# EAGLE design shield (EAGLE 8.7.1)

## Sheet 1 of 2
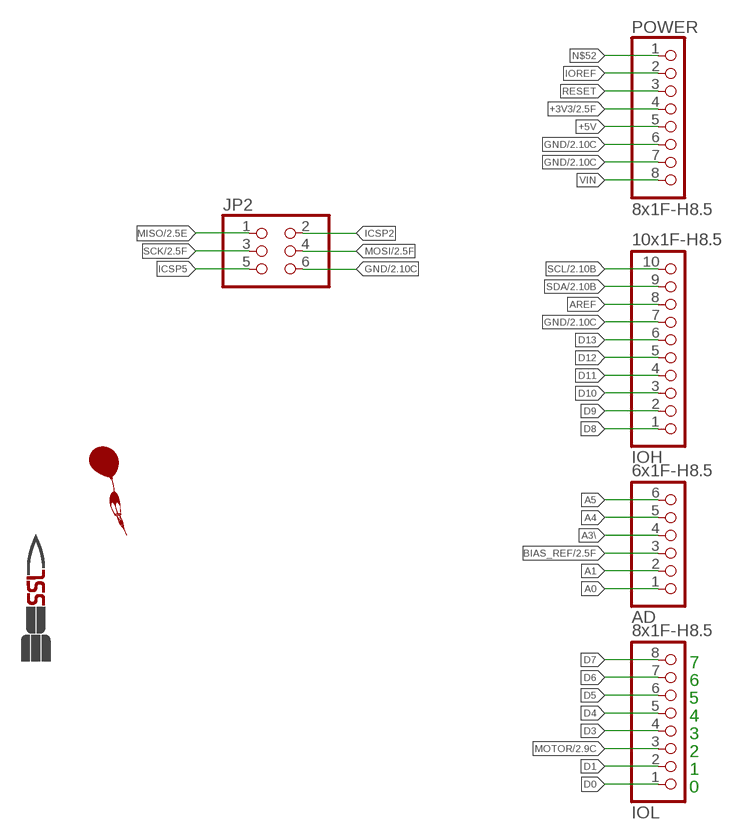
[diagram p0: schematic, sheet 1]

### Parts
AD  6x1F-H8.5  PINHD-1X6  [1X06]
IOH  10x1F-H8.5  PINHD-1X10_ARD  [1X10]
IOL  8x1F-H8.5  PINHD-1X8  [1X08]
JP2  PINHD-2X3  [2X03]
POWER  8x1F-H8.5  PINHD-1X8  [1X08]
U$1  BALLOON  [BALLOON]
U$2  SSLORIG  [SSL]

### Nets
+3V3: POWER.4 ; also sheet 2
+5V: POWER.5
A0: AD.1
A1: AD.2
A3\: AD.4
A4: AD.5
A5: AD.6
AREF: IOH.8
BIAS_REF: AD.3 ; also sheet 2
D0: IOL.1
D1: IOL.2
D3: IOL.4
D4: IOL.5
D5: IOL.6
D6: IOL.7
D7: IOL.8
D8: IOH.1
D9: IOH.2
D10: IOH.3
D11: IOH.4
D12: IOH.5
D13: IOH.6
GND: IOH.7 JP2.6 POWER.6 POWER.7 ; also sheet 2
ICSP2: JP2.2
ICSP5: JP2.5
IOREF: POWER.2
MISO: JP2.1 ; also sheet 2
MOSI: JP2.4 ; also sheet 2
MOTOR: IOL.3 ; also sheet 2
N$52: POWER.1
RESET: POWER.3
SCK: JP2.3 ; also sheet 2
SCL: IOH.10 ; also sheet 2
SDA: IOH.9 ; also sheet 2
VIN: POWER.8

### Notes on the sheet
- 7
- 6
- 5
- 4
- 3
- 2
- 1
- 0

## Sheet 2 of 2
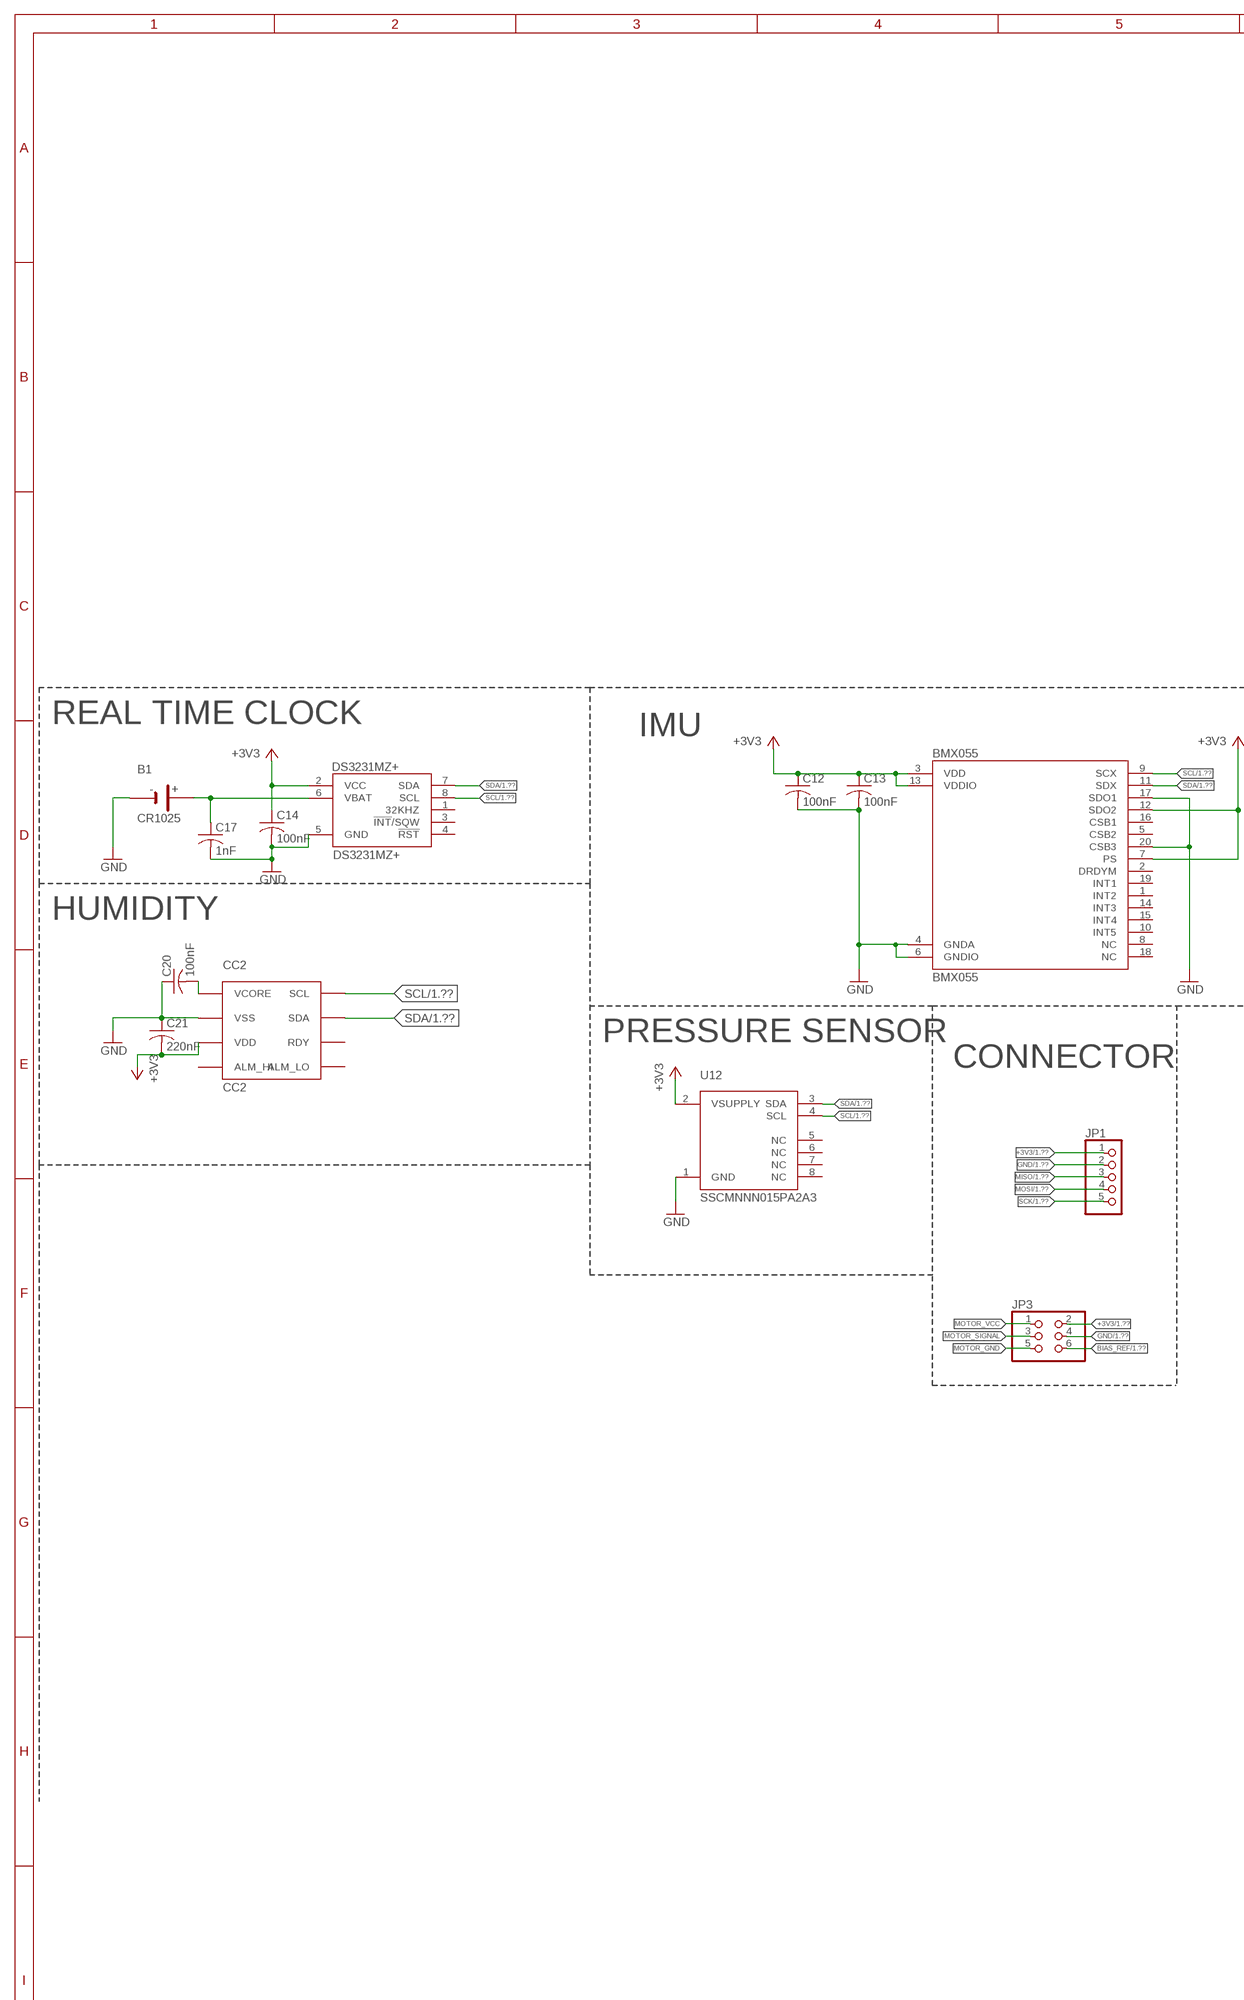
[diagram p1: schematic, sheet 2, part 1 of 2]
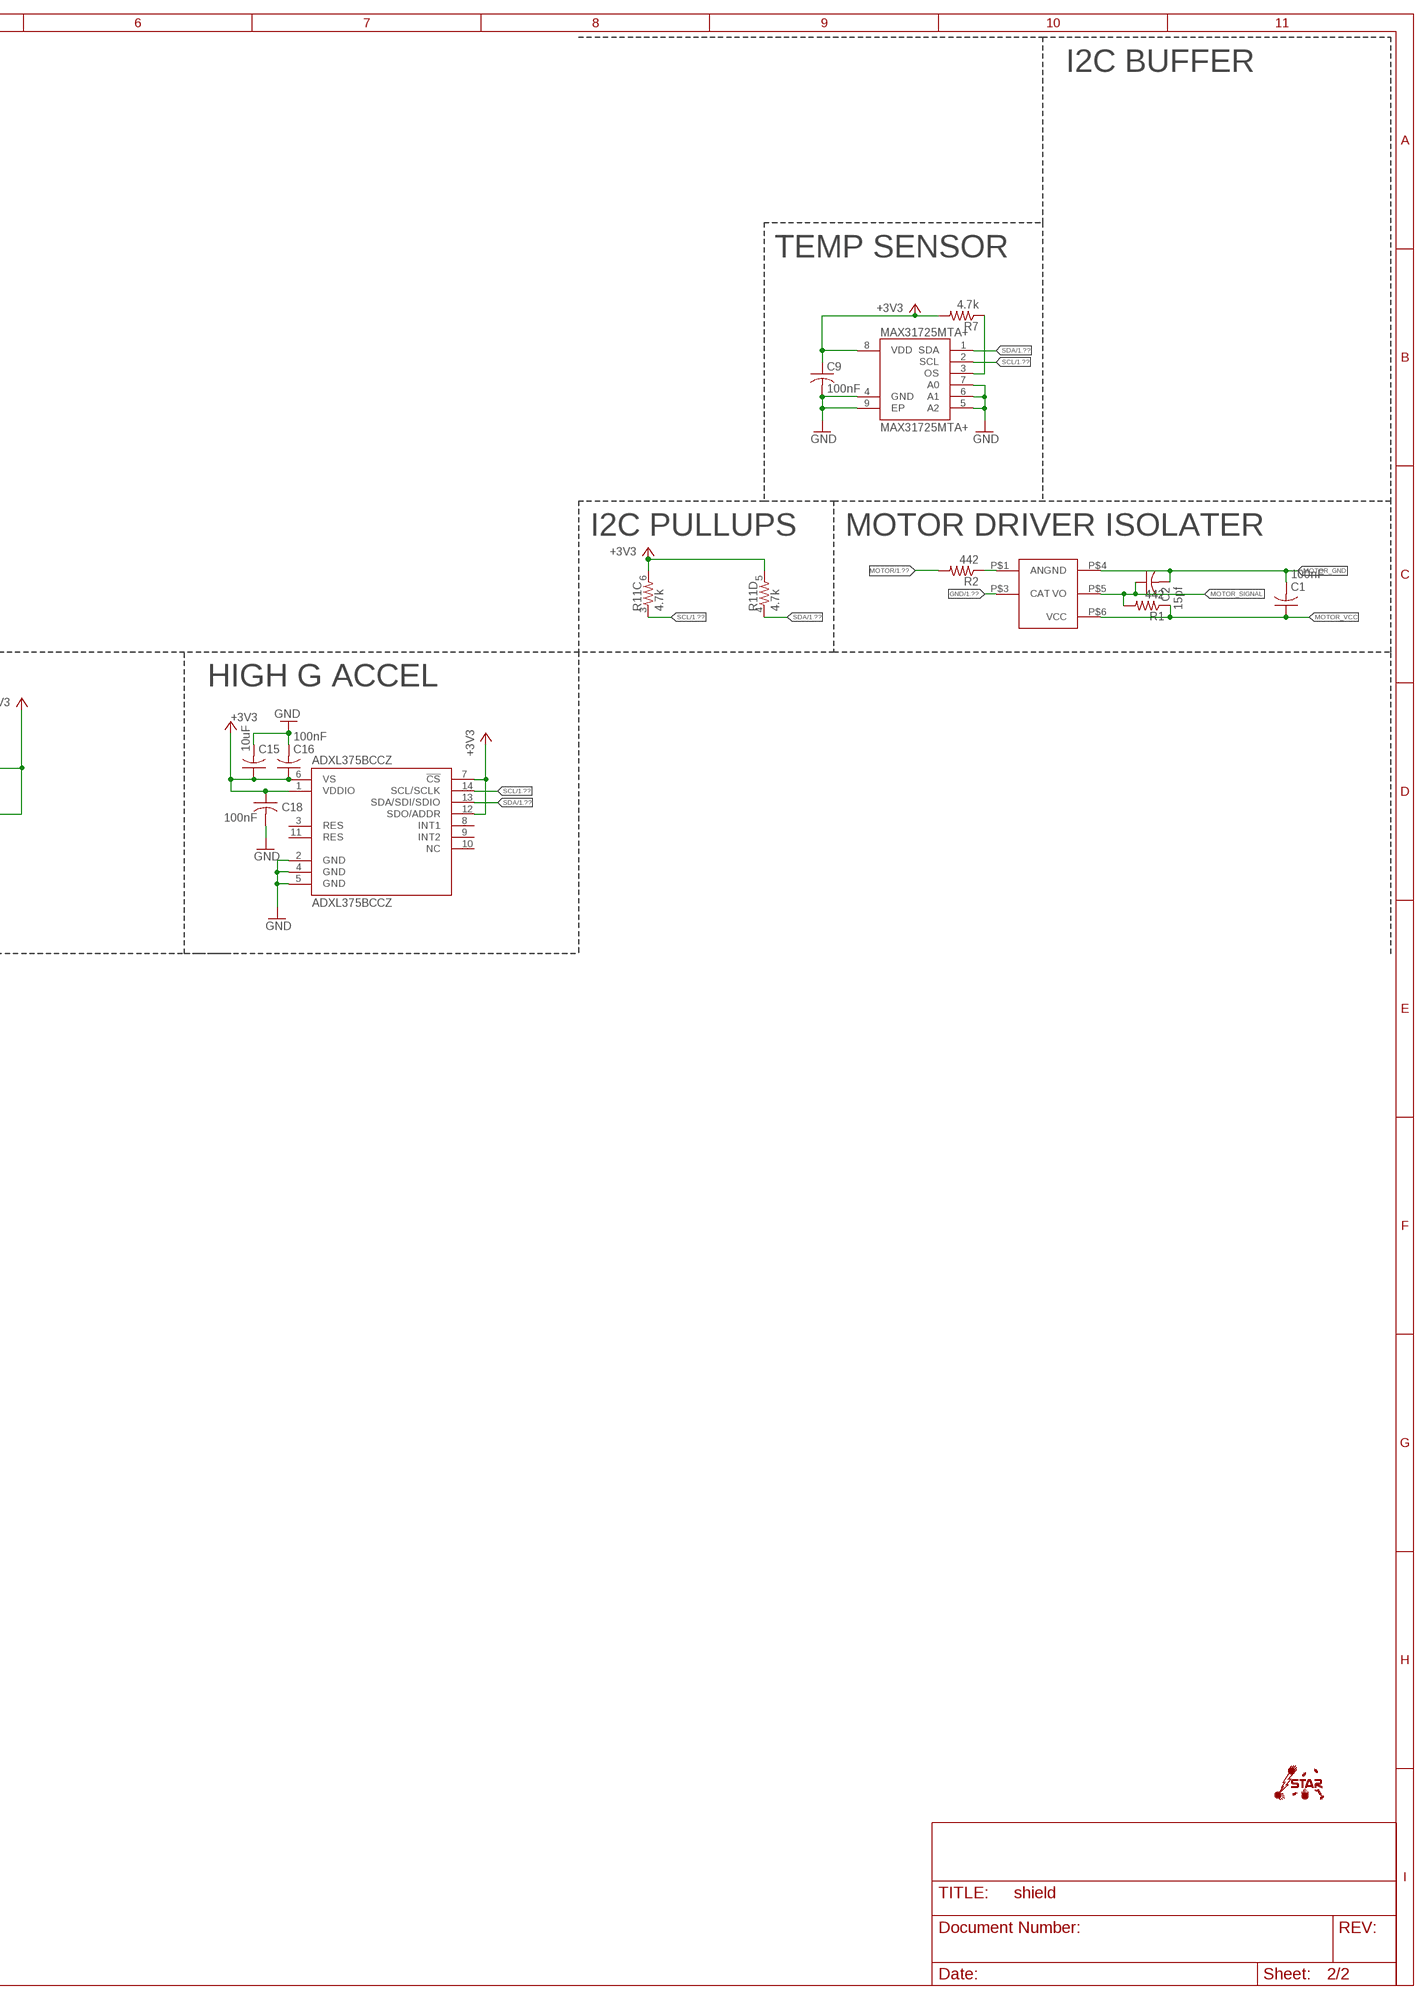
[diagram p2: schematic, sheet 2, part 2 of 2]

### Parts
ADXL375BCCZ  ADXL375BCCZ  [LGA-14]
B1  CR1025  [CR1025]
BMX055  BMX055  [LGA-20]
C1  100nF  C-USC0603  [C0603]
C2  15pf  C-USC0603  [C0603]
C9  100nF  C-USC0603  [C0603]
C12  100nF  C-USC0603  [C0603]
C13  100nF  C-USC0603  [C0603]
C14  100nF  C-USC0603  [C0603]
C15  10uF  C-USC0603  [C0603]
C16  100nF  C-USC0603  [C0603]
C17  1nF  C-USC0603  [C0603]
C18  100nF  C-USC0603  [C0603]
C20  100nF  C-USC0603  [C0603]
C21  220nF  C-USC0603  [C0603]
CC2  CC2  [CC2]
DS3231MZ+  DS3231MZ+  [SOIC-8]
IMAG2  STAR  [STAR_.3IN]
JP1  PINHD-1X5  [1X05]
JP3  PINHD-2X3  [2X03]
MAX31725MTA+  MAX31725MTA+  [DFN-8]
MOTORDRIVER  FODM8061-D  [SO5]
R1  442  R-US_R0805  [R0805]
R2  442  R-US_R0805  [R0805]
R7  4.7k  R-US_R0603  [R0603]
R11  4.7k  RESISTOR-ARRAY0603-ARV  [0603-ARV]
U12  SSCMNNN015PA2A3  [HSC-SMT-8]

### Nets
+3V3: ADXL375BCCZ.1(VDDIO) ADXL375BCCZ.6(VS) ADXL375BCCZ.7(!CS!) ADXL375BCCZ.12(SDO/ADDR) BMX055.3(VDD) BMX055.7(PS) BMX055.12(SDO2) BMX055.13(VDDIO) C9.1 C12.1 C13.1 C14.1 C15.1 C16.1 C18.1 C21.2 CC2.P$7(VDD) DS3231MZ+.2(VCC) JP1.1 JP3.2 MAX31725MTA+.8(VDD) R7.2 R11.5 R11.6 U12.2(VSUPPLY) ; also sheet 1
BIAS_REF: JP3.6 ; also sheet 1
GND: ADXL375BCCZ.2(GND) ADXL375BCCZ.4(GND) ADXL375BCCZ.5(GND) B1.3(-) BMX055.4(GNDA) BMX055.6(GNDIO) BMX055.17(SDO1) BMX055.20(CSB3) C9.2 C12.2 C13.2 C14.2 C15.2 C16.2 C17.2 C18.2 C20.1 C21.1 CC2.P$6(VSS) DS3231MZ+.5(GND) JP1.2 JP3.4 MAX31725MTA+.4(GND) MAX31725MTA+.5(A2) MAX31725MTA+.6(A1) MAX31725MTA+.7(A0) MAX31725MTA+.9(EP) MOTORDRIVER.P$3(CAT) U12.1(GND) ; also sheet 1
MISO: JP1.3 ; also sheet 1
MOSI: JP1.4 ; also sheet 1
MOTOR: R2.2 ; also sheet 1
MOTOR_GND: C1.2 C2.2 JP3.5 MOTORDRIVER.P$4(GND)
MOTOR_SIGNAL: C2.1 JP3.3 MOTORDRIVER.P$5(VO) R1.2
MOTOR_VCC: C1.1 JP3.1 MOTORDRIVER.P$6(VCC) R1.1
N$1: C20.2 CC2.P$5(VCORE)
N$2: MOTORDRIVER.P$1(AN) R2.1
N$30: MAX31725MTA+.3(OS) R7.1
N$31: B1.1(+) B1.2(+) C17.1 DS3231MZ+.6(VBAT)
SCK: JP1.5 ; also sheet 1
SCL: ADXL375BCCZ.14(SCL/SCLK) BMX055.9(SCX) CC2.P$4(SCL) DS3231MZ+.8(SCL) MAX31725MTA+.2(SCL) R11.3 U12.4(SCL) ; also sheet 1
SDA: ADXL375BCCZ.13(SDA/SDI/SDIO) BMX055.11(SDX) CC2.P$3(SDA) DS3231MZ+.7(SDA) MAX31725MTA+.1(SDA) R11.4 U12.3(SDA) ; also sheet 1
Unconnected: ADXL375BCCZ.3(RES) ADXL375BCCZ.8(INT1) ADXL375BCCZ.9(INT2) ADXL375BCCZ.10(NC) ADXL375BCCZ.11(RES) BMX055.1(INT2) BMX055.2(DRDYM) BMX055.5(CSB2) BMX055.8(NC) BMX055.10(INT5) BMX055.14(INT3) BMX055.15(INT4) BMX055.16(CSB1) BMX055.18(NC) BMX055.19(INT1) CC2.P$1(ALM_LO) CC2.P$2(RDY) CC2.P$8(ALM_HI) DS3231MZ+.1(32KHZ) DS3231MZ+.3(!INT!/SQW) DS3231MZ+.4(!RST!) R11.1 R11.2 R11.7 R11.8 U12.5(NC) U12.6(NC) U12.7(NC) U12.8(NC)

### Notes on the sheet
- I2C BUFFER
- TEMP SENSOR
- I2C PULLUPS | MOTOR DRIVER ISOLATER
- REAL TIME CLOCK | HIGH G ACCEL
- IMU
- HUMIDITY
- PRESSURE SENSOR
- CONNECTOR

## Library data of the parts
AD = SmartPrj:PINHD-1X6: PIN HEADER
ADXL375BCCZ = NR_IC:ADXL375BCCZ
B1 = NR_connectors:CR1025
BMX055 = NR_IC:BMX055
C1 C2 C9 C12-C18 C20 C21 = resistor:C-US: CAPACITOR, American symbol
CC2 = NR_IC:CC2
DS3231MZ+ = NR_IC:DS3231MZ+
IMAG2 = images:STAR
IOH = SmartPrj:PINHD-1X10_ARD: PIN HEADER
IOL POWER = SmartPrj:PINHD-1X8: PIN HEADER
JP1 = pinhead:PINHD-1X5: PIN HEADER
JP2 JP3 = pinhead:PINHD-2X3: PIN HEADER
MAX31725MTA+ = NR_IC:MAX31725MTA+
MOTORDRIVER = optoisolater:FODM8061-D
R1 R2 R7 = resistor:R-US_: RESISTOR, American symbol
R11 = SparkFun-Passives:RESISTOR-ARRAY: Array Chip Resistor Source: RS Component / Phycomp
U12 = NR_IC:SSCMNNN015PA2A3
U$1 = images:BALLOON
U$2 = images:SSL

## Net classes
0 default: width 0.152 mm, drill 0.381 mm, clearance 0.152 mm
1 power: width 0.61 mm, drill 0.61 mm, clearance 0.254 mm
2 gnd: width 0.305 mm, drill 0.559 mm, clearance 0.254 mm
3 usbvcc: width 0.508 mm, drill 0.61 mm, clearance 0.254 mm
4 aref: width 0.406 mm, drill 0.61 mm, clearance 0.254 mm

## Board
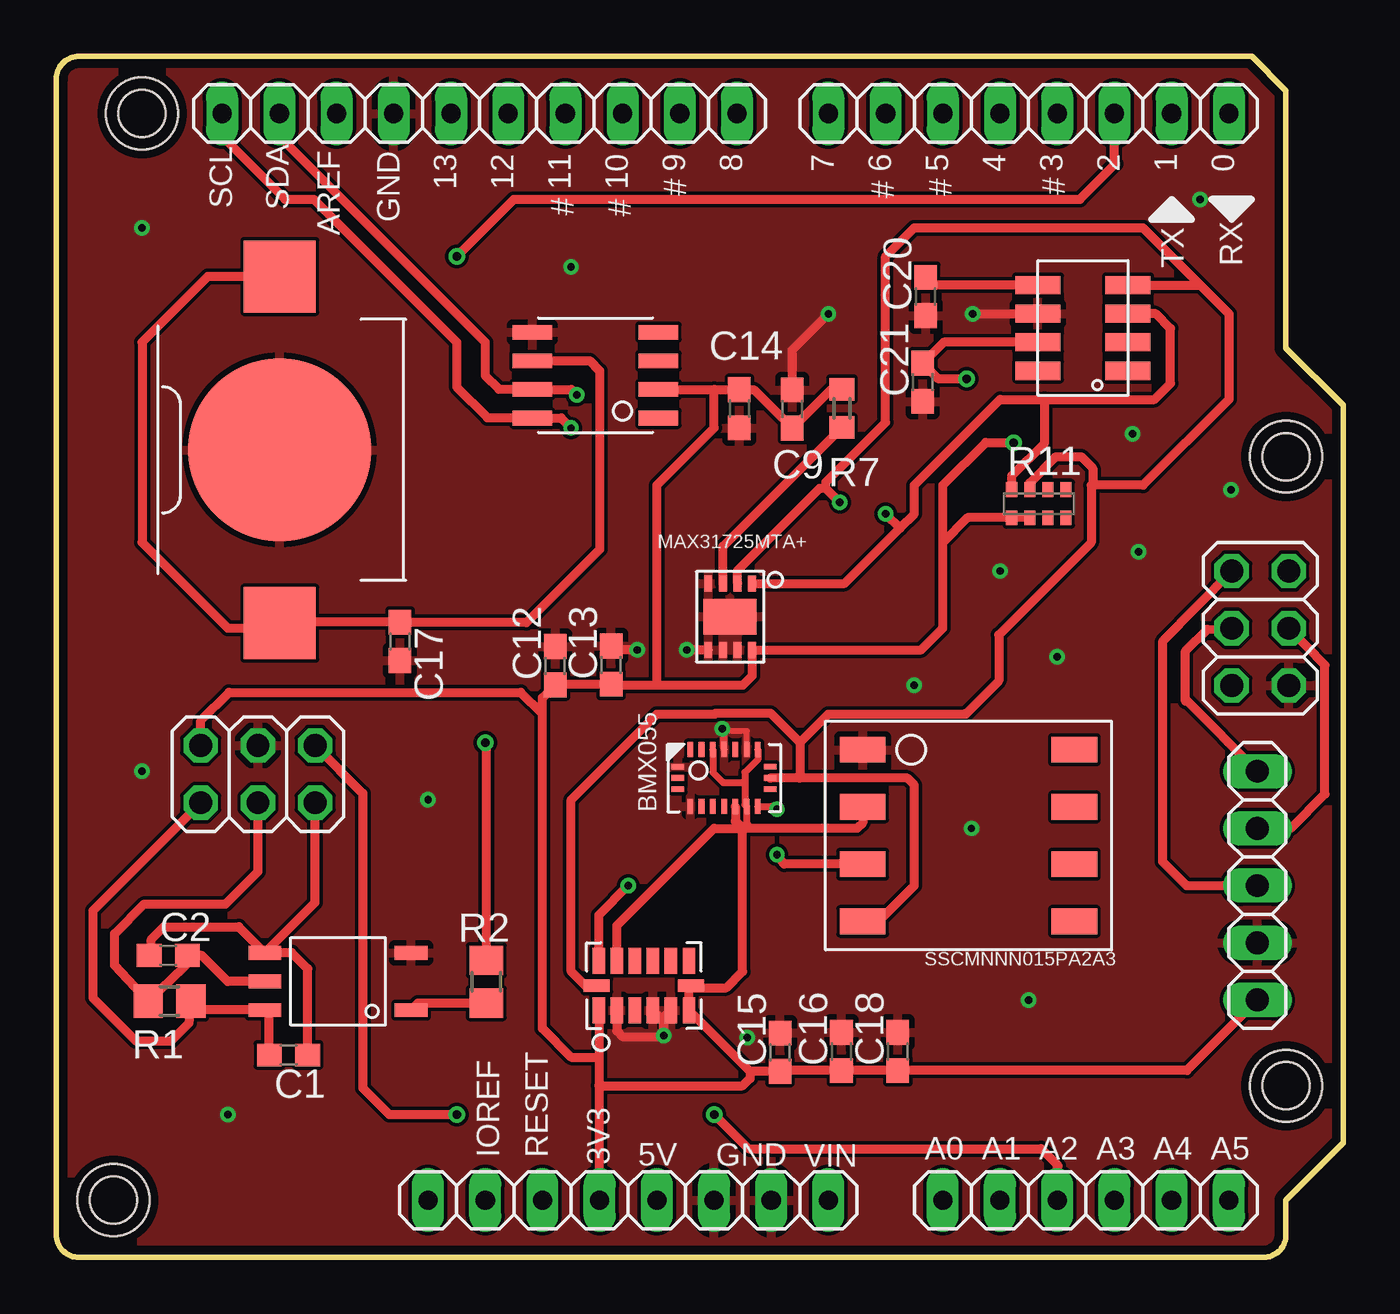
[diagram p3: board, top side]
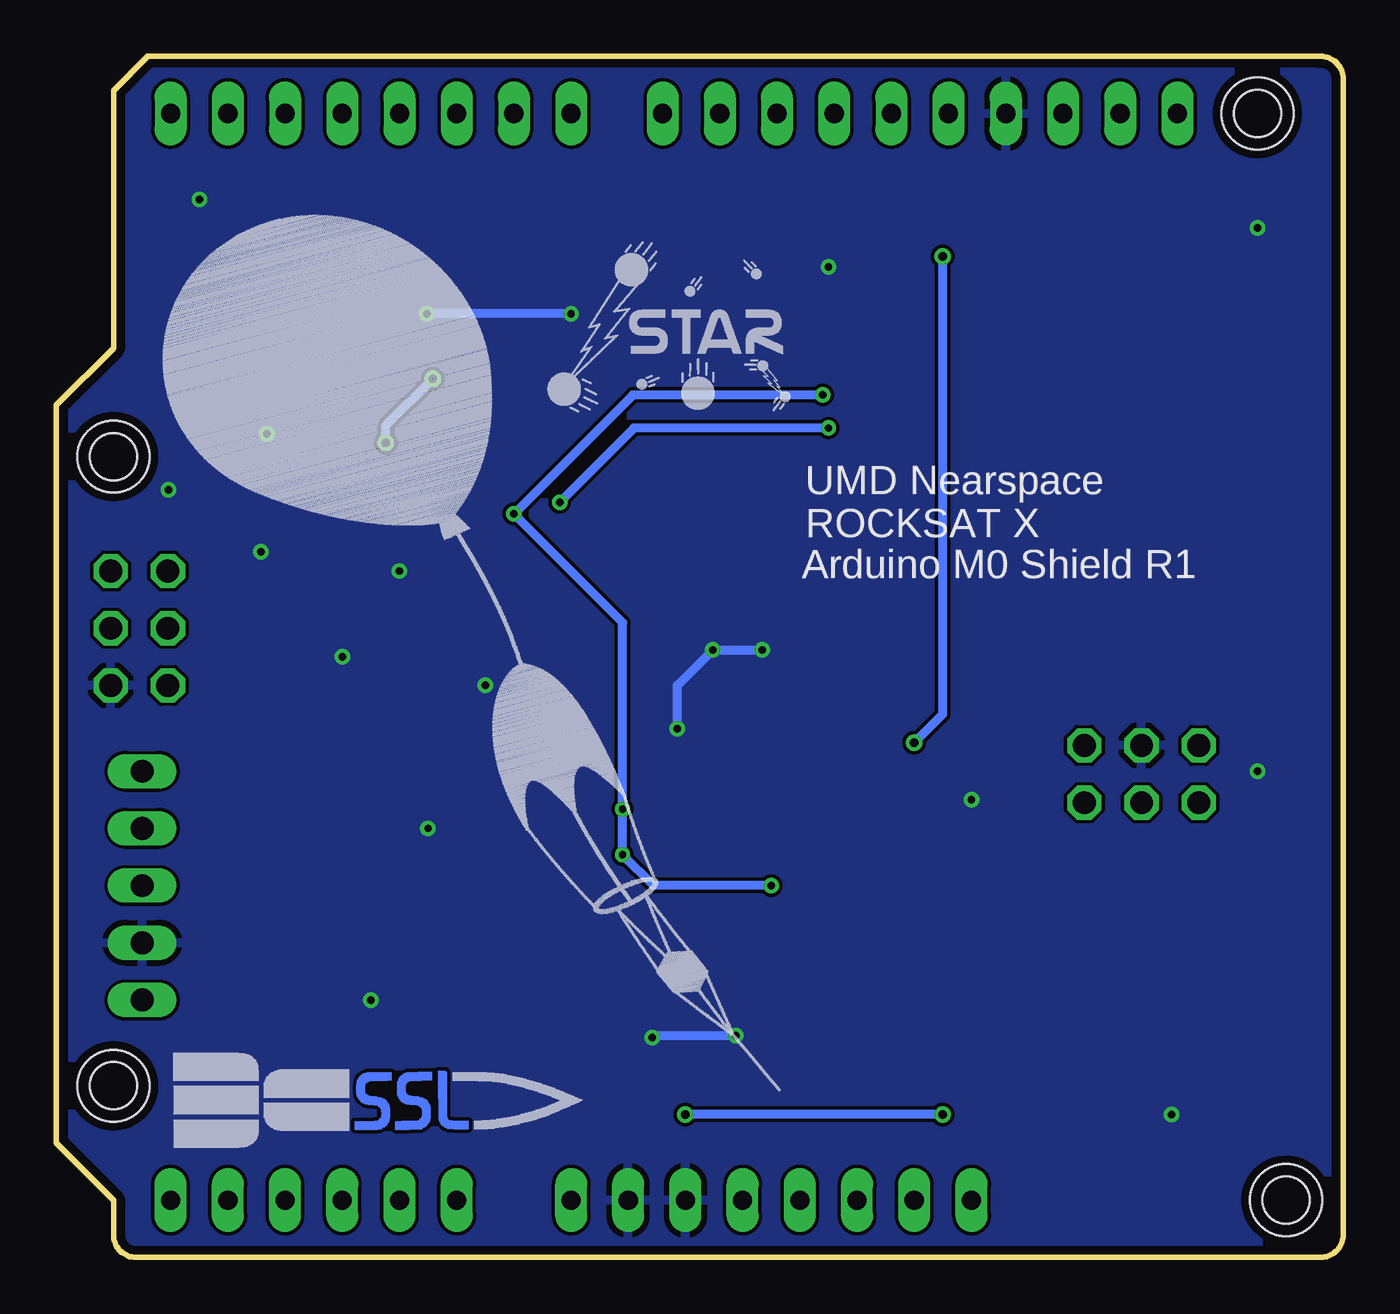
[diagram p4: board, bottom side, seen from below]

Size 57.15 x 53.34 mm. Coordinates in mm from the lower left corner, seen from the top.
Outline: 53.09,53.34 54.61,51.82 54.61,40.39 57.15,37.85 57.15,5.08 54.61,2.54 54.61,1 arc-90 53.61,0 1,0 arc-90 0,1 0,52.34 arc-90 1.02,53.34 53.09,53.34
Copper layers (1*16): Top 0.0356mm / dielectric 1.5011mm / Bottom 0.0356mm
Design rules "OshPark": minimum track width 6mil, minimum drill 13mil, track to track 6mil, track to pad 6mil, pad to pad 6mil, via to via 6mil, smd to smd 6mil, copper to edge 15mil, drill to drill 6mil, minimum pad ring 7mil, minimum via ring 7mil, stop-mask expansion 3mil, vias tented up to drill 0mil, thermal gap 10mil
Holes 3.2 mm at 54.61,35.56 54.61,7.62 3.81,50.8 2.54,2.54
Holes 2.1 mm at 3.81,50.8 54.61,35.56 54.61,7.62 2.54,2.54
vRestrict: area 11.4,44.1 to 13.2,49.1; area 14,45.5 to 15.6,49.1; area 17,45.3 to 18.2,48.8; area 19.6,45.3 to 20.7,48.8; area 22.1,45.3 to 23.2,48.8; area 24.6,45.3 to 25.8,48.8; area 27.3,47.2 to 28.4,48.8; area 28.8,45.1 to 36.2,46.9; area 48.9,44.2 to 50.3,46.7; area 51.4,44.2 to 52.8,46.7; area 49.9,35.8 to 53.3,37.2; area -10.8,21.8 to -9.4,30.1; 14 more areas

### Footprints (pad centres in the part's own frame; a part is rotated, then mirrored left to right if it is on the bottom)
1X06 = drill 0.85 pad 1.422 long: 1 -6.35,0; 2 -3.81,0; 3 -1.27,0; 4 1.27,0; 5 3.81,0; 6 6.35,0
LGA-14 = smd 1.145 x 0.55: 1 -1.097,2; 2 -1.097,1.2; 3 -1.097,0.4; 4 -1.097,-0.4; 5 -1.097,-1.2; 6 -1.097,-2; 8 1.097,-2; 9 1.097,-1.2; 10 1.097,-0.4; 11 1.097,0.4; 12 1.097,1.2; 13 1.097,2 | smd 0.55 x 1.145: 7 0,-2.098; 14 0,2.098
CR1025 = smd 3.2 x 3.2: 1 -7.695,0; 2 7.695,0 | smd 8.13 x 8.13: 3 0,0
LGA-20 = smd 0.675 x 0.25: 1 1.262,1.5; 2 1.262,1; 3 1.262,0.5; 4 1.262,0; 5 1.262,-0.5; 6 1.262,-1; 7 1.262,-1.5; 11 -1.262,-1.5; 12 -1.262,-1; 13 -1.262,-0.5; 14 -1.262,0; 15 -1.262,0.5; 16 -1.262,1; 17 -1.262,1.5 | smd 0.25 x 0.55: 8 0.5,-2.05; 9 0,-2.05; 10 -0.5,-2.05; 18 -0.5,2.05; 19 0,2.05; 20 0.5,2.05
C0603 = smd 1.1 x 1: 1 -0.85,0; 2 0.85,0
CC2 = smd 2 x 0.8: P$1 2,-1.905; P$2 2,-0.635; P$3 2,0.635; P$4 2,1.905; P$5 -2,1.905; P$6 -2,0.635; P$7 -2,-0.635; P$8 -2,-1.905
SOIC-8 = smd 0.65 x 1.75: 1 -1.905,-2.8; 2 -0.635,-2.8; 3 0.635,-2.8; 4 1.905,-2.8; 5 1.905,2.8; 6 0.635,2.8; 7 -0.635,2.8; 8 -1.905,2.8
1X10 = drill 0.85 pad 1.422 long: 1 -11.43,0; 2 -8.89,0; 3 -6.35,0; 4 -3.81,0; 5 -1.27,0; 6 1.27,0; 7 3.81,0; 8 6.35,0; 9 8.89,0; 10 11.43,0
1X08 = drill 0.85 pad 1.422 long: 1 -8.89,0; 2 -6.35,0; 3 -3.81,0; 4 -1.27,0; 5 1.27,0; 6 3.81,0; 7 6.35,0; 8 8.89,0
1X05 = drill 1.016 long: 1 -5.08,0; 2 -2.54,0; 3 0,0; 4 2.54,0; 5 5.08,0
2X03 = drill 1.016 octagon: 1 -2.54,-1.27; 2 -2.54,1.27; 3 0,-1.27; 4 0,1.27; 5 2.54,-1.27; 6 2.54,1.27
DFN-8 = smd 0.7 x 0.35: 1 -1.475,0.975; 2 -1.475,0.325; 3 -1.475,-0.325; 4 -1.475,-0.975; 5 1.475,-0.975; 6 1.475,-0.325; 7 1.475,0.325; 8 1.475,0.975 | smd 1.58 x 2.35: 9 0,0
SO5 = smd 0.61 x 1.45: P$1 1.27,3.25; P$3 -1.27,3.25; P$4 -1.27,-3.25; P$5 0,-3.25; P$6 1.27,-3.25
R0805 = smd 1.3 x 1.5: 1 -0.95,0; 2 0.95,0
R0603 = smd 1 x 1.1: 1 -0.85,0; 2 0.85,0
0603-ARV = smd 0.5 x 0.65: 1 -1.2,-0.625; 2 -0.4,-0.625; 3 0.4,-0.625; 4 1.2,-0.625; 5 1.2,0.625; 6 0.4,0.625; 7 -0.4,0.625; 8 -1.2,0.625
HSC-SMT-8 = smd 1.143 x 2.032: 1 -3.81,-4.699; 2 -1.27,-4.699; 3 1.27,-4.699; 4 3.81,-4.699; 5 3.81,4.699; 6 1.27,4.699; 7 -1.27,4.699; 8 -3.81,4.699

### Placement (x,y rotation side)
AD  45.72,2.54 0 top
ADXL375BCCZ  26.1,12.07 90 top
B1  9.92,35.86 90 top
BMX055  29.65,21.29 90 top
C1  10.31,8.99 0 top
C2  4.98,13.41 180 top
C9  32.69,37.67 90 top
C12  22.16,26.27 90 top
C13  24.64,26.3 90 top
C14  30.34,37.69 270 top
C15  32.15,9.11 90 top
C16  34.87,9.15 90 top
C17  15.26,27.36 270 top
C18  37.37,9.15 90 top
C20  38.61,42.67 90 top
C21  38.48,38.86 90 top
CC2  45.59,41.27 0 top
DS3231MZ+  23.94,39.18 90 top
IMAG2  35.32,37.54 0 bottom
IOH  18.8,50.8 180 top
IOL  43.18,50.8 180 top
JP1  53.34,16.51 90 top
JP2  53.47,27.94 270 top
JP3  8.95,21.46 0 top
MAX31725MTA+  29.93,28.45 270 top
MOTORDRIVER  12.51,12.26 270 top
POWER  25.4,2.54 0 top
R1  5.03,11.38 180 top
R2  19.1,12.24 90 top
R7  34.89,37.71 90 top
R11  43.63,33.47 180 top
U12  40.51,18.73 270 top
U$1  42.67,2.67 15 bottom
U$2  51.94,9.91 270 bottom

### Tracks (layer width: path | path; a pad name or v marks a point on that pad's centre or on a via)
+3V3  (via drill 0.38)
  Top 0.305: 30.65,19.22 BMX055.12 30.58,20.1 30.58,21.08 | BMX055.7 31.15,22.11 30.58,21.54 30.58,21.08 | BMX055.3 29.15,21.54 29.62,21.08 30.58,21.08
  Top 0.406: CC2.P$7 39.41,40.64 C21.2 39.18,39.01 v40.44,39.01 | 30.81,8.26 C15.1 32.18,8.3 C16.1 C18.1 50.21,8.3 JP1.1 | 30.81,8.26 ADXL375BCCZ.6 28.09,11.97 | 28.09,11.97 ADXL375BCCZ.7 | ADXL375BCCZ.1 24.09,8.89 | 24.09,8.89 24.09,7.62 | 24.09,7.62 24.09,2.58 POWER.4 | ADXL375BCCZ.12 24.9,14.73 29.21,19.05 30.48,19.05 | 28.09,11.97 29.75,11.97 30.48,12.7 30.48,19.05 | 24.09,7.62 30.48,7.62 30.81,7.95 30.81,8.26 | U12.2 35.81,19.3 35.56,19.05 30.48,19.05 | BMX055.13 30.15,19.38 30.48,19.05 | 30.65,19.22 30.48,19.05 | DS3231MZ+.2 29.21,38.54 | 29.21,38.54 C14.1 30.98,38.54 C9.1 34.42,38.56 R7.2 | 26.67,25.4 30.48,25.4 30.9,25.82 MAX31725MTA+.8 38.41,26.98 39.37,27.94 39.37,31.75 | 26.67,25.4 24.7,25.4 C13.1 22.19,25.45 C12.1 21.59,24.85 21.59,24.13 | 26.67,25.4 26.67,34.29 29.21,36.83 29.21,38.54 | 21.59,24.13 21.59,11.43 21.59,10.16 22.86,8.89 24.09,8.89 | 39.37,31.75 39.37,34.29 41.27,36.2 42.49,36.2 v42.52,36.17 | JP3.2 6.41,23.84 7.67,25.09 20.62,25.09 21.59,24.13 | R11.6 R11.5 40.47,32.85 39.37,31.75
  Bottom 0.406: v42.52,36.17 42.52,36.93 v40.44,39.01
BIAS_REF  (via drill 0.38)
  Top 0.406: JP3.6 13.61,20.61 13.61,7.52 14.78,6.35 v17.78,6.35 | v29.21,6.35 30.73,4.83 43.74,4.83 44.5,4.06 44.45,4.01 AD.3
  Bottom 0.406: v17.78,6.35 v29.21,6.35
GND  (via drill 0.33)
  Top 0.254: BMX055.6 30.65,23.34 30.68,23.37 29.67,23.37 29.65,23.38
  Top 0.305: BMX055.4 29.65,23.38
  Top 0.406: v26.98,9.86 26.98,10.49 ADXL375BCCZ.4 | ADXL375BCCZ.5 26.98,10.65 v26.98,9.86 | ADXL375BCCZ.2 24.9,10.05 25.15,9.8 26.92,9.8 v26.98,9.86 | MAX31725MTA+.5 v27.99,26.98 | v25.81,26.98 24.82,26.98 C13.2 | 29.65,23.38 v29.57,23.47 | C9.2 32.69,40.31 v34.29,41.91 | v40.69,41.91 CC2.P$6
  Bottom 0.406: v30.68,9.75 30.58,9.86 v26.98,9.86 | v25.81,26.98 v27.99,26.98 29.57,25.4 v29.57,23.47 | v34.29,41.91 v40.69,41.91
  other vias: 52.17,34.09 48.06,31.34 3.81,45.72 22.86,43.99 50.8,46.99 16.51,20.32 3.81,21.59 7.62,6.35 43.18,11.43 44.45,26.67 40.64,19.05 41.91,30.48 38.1,25.4 47.8,36.58
  pour Top: -1.27,54.61 58.42,54.61 58.42,-1.27 -1.27,-1.27
  pour Bottom: -5.08,55.88 60.96,55.88 60.96,-6.35 -5.08,-6.35
MISO
  Top 0.406: JP2.1 49.12,27.34 49.12,17.58 50.19,16.51 JP1.3
MOSI
  Top 0.406: JP2.4 56.34,26.3 56.34,20.57 54.81,19.05 JP1.4
MOTOR  (via drill 0.38)
  Top 0.406: R2.2 19.1,22.81 v19.05,22.86 | v17.78,44.45 20.32,46.99 45.47,46.99 47.04,48.56 46.99,48.62 IOL.3
  Bottom 0.406: v19.05,22.86 17.78,24.13 v17.78,44.45
MOTOR_GND
  Top 0.406: C2.2 4.22,13.5 4.22,14.12 4.77,14.68 8.1,14.68 MOTORDRIVER.P$4 | C1.2 11.16,12.81 10.45,13.53 MOTORDRIVER.P$4 | MOTORDRIVER.P$4 11.49,15.76 JP3.5
MOTOR_SIGNAL
  Top 0.406: MOTORDRIVER.P$5 7.62,12.26 6.46,13.41 6.35,13.41 | 6.35,13.41 C2.1 | 6.35,13.41 6.21,13.41 R1.2 2.59,12.97 2.59,14.38 3.91,15.7 7.52,15.7 8.95,17.13 JP3.3
MOTOR_VCC
  Top 0.406: C1.1 9.46,10.78 MOTORDRIVER.P$6 6.27,10.99 R1.1 5.88,10.4 5.08,9.6 3.56,9.6 1.63,11.53 1.63,15.39 JP3.1
N$1
  Top 0.406: CC2.P$5 38.95,43.18 C20.2
N$2
  Top 0.406: MOTORDRIVER.P$1 16.07,11.29 R2.1
N$30
  Top 0.406: MAX31725MTA+.3 29.6,31.57 R7.1
N$31
  Top 0.406: B1.2 6.73,43.56 3.81,40.64 3.81,31.75 7.62,27.94 9.7,27.94 B1.1 9.96,28.21 C17.1 15.27,28.19 20.88,28.19 24.13,31.45 24.13,39.37 23.69,39.81 DS3231MZ+.6
SCK
  Top 0.406: JP1.5 50.24,24.69 50.14,24.69 50.14,26.92 51.1,27.89 JP2.3
SCL  (via drill 0.33)
  Top 0.406: CC2.P$4 50.8,43.18 | 50.8,43.18 52.07,41.91 52.07,38.1 48.26,34.29 45.96,34.29 | 45.96,34.29 45.96,31.75 41.86,27.65 41.86,25.6 40.39,24.13 40.28,24.13 34.29,24.13 33.02,22.86 | IOH.10 7.37,49.78 10.16,46.99 11.43,46.99 17.78,40.64 17.78,38.66 19.15,37.29 21.13,37.29 DS3231MZ+.8 22.42,37.27 v22.86,36.83 | 50.8,43.18 48.26,45.72 38.1,45.72 36.83,44.45 36.83,37.08 34.16,34.42 34.16,34.16 | U12.4 36.51,14.92 38.1,16.51 38.1,20.98 37.8,21.29 33.02,21.29 | 33.02,21.29 BMX055.9 | v34.8,33.53 34.16,34.16 | ADXL375BCCZ.14 23.49,12.07 22.86,12.7 22.86,20.32 26.67,24.13 29.24,24.13 29.28,24.17 31.71,24.17 33.02,22.86 | 33.02,22.86 33.02,21.29 | MAX31725MTA+.2 30.25,30.51 33.91,34.16 34.16,34.16 | R11.3 43.23,34.39 44.4,35.56 45.52,35.56 46.02,35.05 46.02,34.35 45.96,34.29
  Bottom 0.406: v22.86,36.83 31.5,36.83 v34.8,33.53
SDA  (via drill 0.33)
  Top 0.305: BMX055.11 31.89,20.03
  Top 0.406: U12.3 32.32,17.46 v32,17.88 | 31.89,20.03 v32,19.91 | IOH.9 9.91,49.78 19.05,40.64 19.05,39.17 19.66,38.56 21.13,38.56 DS3231MZ+.7 22.87,38.54 v23.11,38.3 | MAX31725MTA+.1 35.01,29.93 37.47,32.38 | 37.47,32.38 38.1,33.02 38.1,34.29 41.91,38.1 43.89,38.1 | ADXL375BCCZ.13 24.09,15.21 v25.4,16.51 | v36.83,33.02 37.47,32.38 | R11.4 42.43,34.71 43.89,36.17 43.89,38.1 | 43.89,38.1 48.77,38.1 49.48,38.81 49.48,41.25 48.82,41.91 CC2.P$3
  Bottom 0.406: v25.4,16.51 30.63,16.51 v32,17.88 v32,19.91 32,28.19 v36.83,33.02 31.55,38.3 v23.11,38.3

### Text on the board
tPlace: 13 | 12 | 11 | 10 | 9 | 8 | 7 | 6 | 5 | 4 | 3 | 2 | 1 | 0
bPlace: UMD Nearspace / ROCKSAT X | Arduino M0 Shield R1
tNames: AREF | GND | SCL | SDA | # | # | # | # | # | # | TX | RX | IOREF | RESET | 3V3 | 5V | GND | VIN | A0 | A1 | A2 | A3 | A4 | A5
ReferenceLC: L | TX | ON | RX | PC1 | PC2
ASM_Res: 4.7k | 10k | 3.6k | 4.7k | 4.7k | 6.8k | 4.7k | 10k | 100k | 10k | 845k | 33k | 158k | 4.7k | 100k | 191k | 100k | 191k | 191k | 10k | 1.05 | 1.05 | 33k | 100k | 191k | 6.2 | 10k | 4.7k | 4.7k | 4.7k | 330 | 270k
ASM_IC: P82B75 | MIC5319 | MT25QL | FDG8842 | SAMD21 | FDG8842 | FDG8842 | FDG8842 | LTC3112 | TCA9535 | DS3231 | MC14504 | ADXL375 | MAX31275 | BMX055 | LT8301 | LT3465 | PCA9306
ASM_Cap: 6.8pF | 100nF | 6.8pF | 100nF | 47uF | 10uF | 47pF | 1uF | 4.7uF | 1uF | 100nF | 1uF | 680pF | 22pF | 1uF | 100nF | 2.2uF | 100nF | 100nF | 10uF | 100nF | 1uF | 4.7uF | 100nF | 10uF | 100nF | 1nF | 1uF | 100nF | 10uF | 100nF | 100nF | 10uF | 100nF | 100nF | 10uF | 100nF | 100nF
ASM_Misc: 10uH | 10uH | 10uH | 10uH | 32kHz | 4.7uH | STPS1150 | CMHD4448 | 22uH | Ferrite Bead | CMDZ5257B
214bmp: D:/SmartProjects/Snc/a4_bn_logo2.bmp